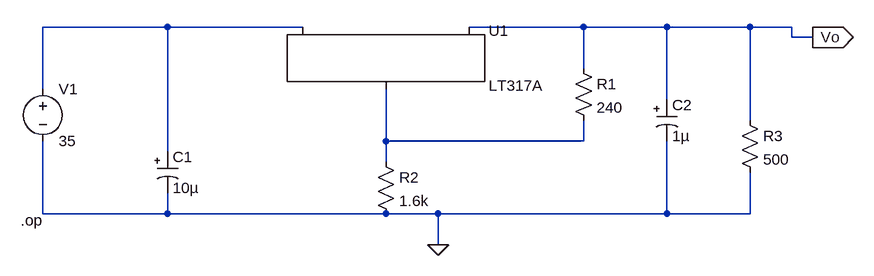
[diagram p0: schematic ec2 voltage regulator.asc]
ec2 voltage regulator.asc, the LTspice schematic file:
Version 4
SHEET 1 880 680
WIRE -224 -16 -416 -16
WIRE -16 -16 -224 -16
WIRE 416 -16 240 -16
WIRE 544 -16 416 -16
WIRE 672 -16 544 -16
WIRE 736 -16 672 -16
WIRE 736 0 736 -16
WIRE 768 0 736 0
WIRE 416 48 416 -16
WIRE -416 80 -416 -16
WIRE 544 96 544 -16
WIRE 672 128 672 -16
WIRE 112 160 112 80
WIRE 416 160 416 128
WIRE 416 160 112 160
WIRE -224 176 -224 -16
WIRE 112 192 112 160
WIRE -416 272 -416 160
WIRE -224 272 -224 240
WIRE -224 272 -416 272
WIRE 112 272 -224 272
WIRE 192 272 112 272
WIRE 544 272 544 160
WIRE 544 272 192 272
WIRE 672 272 672 208
WIRE 672 272 544 272
WIRE 192 320 192 272
FLAG 192 320 0
FLAG 768 0 Vo
IOPIN 768 0 Out
SYMBOL PowerProducts\\LT317A 112 -16 R0
SYMATTR InstName U1
SYMBOL res 400 32 R0
SYMATTR InstName R1
SYMATTR Value 240
SYMBOL res 96 176 R0
SYMATTR InstName R2
SYMATTR Value 1.6k
SYMBOL res 656 112 R0
SYMATTR InstName R3
SYMATTR Value 500
SYMBOL polcap -240 176 R0
WINDOW 3 24 56 Left 2
SYMATTR InstName C1
SYMATTR Value 10µ
SYMATTR Description Capacitor
SYMATTR Type cap
SYMATTR SpiceLine V=10 Irms=170m Rser=1 Lser=0
SYMBOL polcap 528 96 R0
WINDOW 3 24 56 Left 2
SYMATTR InstName C2
SYMATTR Value 1µ
SYMATTR Description Capacitor
SYMATTR Type cap
SYMATTR SpiceLine V=10 Irms=170m Rser=1 Lser=0
SYMBOL voltage -416 64 R0
SYMATTR InstName V1
SYMATTR Value 35
TEXT -450 282 Left 2 !.op

The netlist it stands for:
* ec2 voltage regulator.asc
XU1 N002 Vo N001 LT317A
R1 Vo N002 240
R2 N002 0 1.6k
R3 Vo 0 500
C1 N001 0 10µ V=10 Irms=170m Rser=1 Lser=0
C2 Vo 0 1µ V=10 Irms=170m Rser=1 Lser=0
V1 N001 0 35
.op
.lib LTC.lib
.backanno
.end